# Altium project PCB_Prototype2.PrjPCB
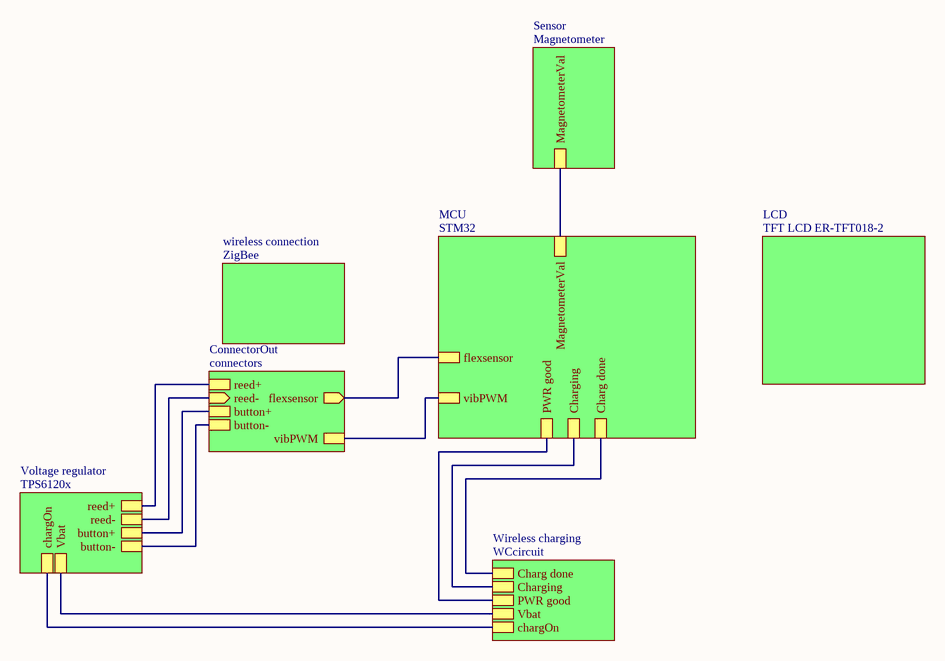
[diagram p0: HGCD.SchDoc]
8 sheets, 85 parts. Net scope: global (net labels, ports and power ports of the same name join across sheets).
Board file: HGCD.PcbDoc
Sheets:
  HGCD.SchDoc
    ConnectorOut = connectors.SchDoc
    wireless connection = ZigBee.SchDoc
    MCU = STM32.SchDoc
    Sensor = Magnetometer.SchDoc
    Voltage regulator = TPS6120x.SchDoc
    Wireless charging = WCcircuit.SchDoc
    LCD = TFT LCD ER-TFT018-2.SchDoc

## Sheet HGCD.SchDoc
size A4

### Sub-sheets
ConnectorOut = connectors: reed- (in), reed+, flexsensor (out), vibPWM, button+, button-
LCD = TFT LCD ER-TFT018-2: no entries
MCU = STM32: flexsensor, vibPWM, MagnetometerVal, Charg done, Charging, PWR good
Sensor = Magnetometer: MagnetometerVal
Voltage regulator = TPS6120x: Vbat, reed-, reed+, button-, button+, chargOn
Wireless charging = WCcircuit: Charg done, Charging, PWR good, Vbat, chargOn
wireless connection = ZigBee: no entries

### Nets
(unnamed): sheet ConnectorOut/reed-, sheet Voltage regulator/reed-
(unnamed): sheet ConnectorOut/reed+, sheet Voltage regulator/reed+
(unnamed): sheet ConnectorOut/flexsensor, sheet MCU/flexsensor
(unnamed): sheet ConnectorOut/vibPWM, sheet MCU/vibPWM
(unnamed): sheet ConnectorOut/button+, sheet Voltage regulator/button+
(unnamed): sheet ConnectorOut/button-, sheet Voltage regulator/button-
(unnamed): sheet MCU/MagnetometerVal, sheet Sensor/MagnetometerVal
(unnamed): sheet MCU/Charg done, sheet Wireless charging/Charg done
(unnamed): sheet MCU/Charging, sheet Wireless charging/Charging
(unnamed): sheet MCU/PWR good, sheet Wireless charging/PWR good
(unnamed): sheet Voltage regulator/Vbat, sheet Wireless charging/Vbat
(unnamed): sheet Voltage regulator/chargOn, sheet Wireless charging/chargOn

## Sheet connectors.SchDoc
size A4
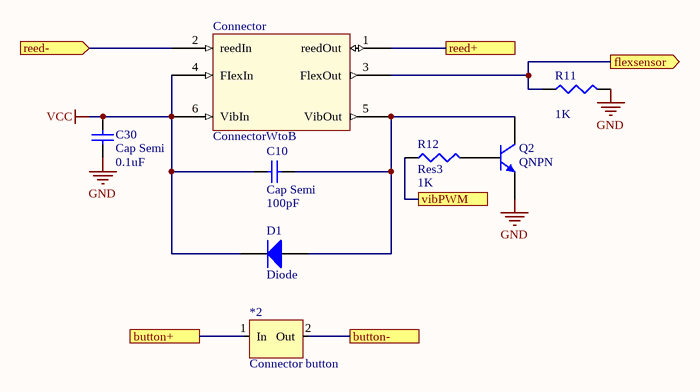
[diagram p1: connectors.SchDoc]

### Parts
*2  Connector button  [Button_connector]
C10  Cap Semi  value 100pF  [1608[0603]]
C30  Cap Semi  value 0.1uF  [1608[0603]]
Connector  ConnectorWtoB  [Connector_wire_to_PCB]
D1  Diode  [SMC]
Q2  QNPN  [SOT-23B_N]
R11  value 1K  [J1-0603]  (hidden comment: Res3)
R12  Res3  value 1K  [J1-0603]

### Ports
button+, button-, flexsensor (out), reed+, reed- (in), vibPWM

### Nets
GND: C30.1 Q2.3(E) R11.2
VCC: *2.2(Out) C10.1 C30.2 Connector.2(reedIn) Connector.4(FIexIn) Connector.6(VibIn) D1.2(K) ; port reed-, port button-
Net*2_1: *2.1(In) Connector.1(reedOut) ; port reed+, port button+
NetC10_2: C10.2 Connector.5(VibOut) D1.1(A) Q2.1(C)
NetConnector_3: Connector.3(FlexOut) R11.1 ; port flexsensor
NetQ2_2: Q2.2(B) R12.2
NetR12_1: R12.1 ; port vibPWM

### Library data of the parts
C10 C30 = Cap Semi: Capacitor (Semiconductor SIM Model); Published: 8-Jun-2000; LatestRevisionDate: 29-May-2009; LatestRevisionNote: IPC-7351 Footprint Added.; PackageReference: C1206; Publisher: Altium Limited; PackageDescription: Chip Capacitor
D1 = Diode: Default Diode; Published: 8-Jun-2000; LatestRevisionDate: 17-Jul-2002; LatestRevisionNote: Re-released for DXP Platform.; PackageVersion: Sep-1996; PackageReference: SMC; Publisher: Altium Limited; PackageDescription: DO-214-AB/SMC; 2 C-Bend Leads; Body 7.9 x 5.9 mm, inc. leads (LxW); Code_JEDEC: DO-214-AB
Q2 = QNPN: NPN Bipolar Transistor; Published: 8-Jun-2000; LatestRevisionDate: 29-May-2009; LatestRevisionNote: IPC-7351 Footprint Added.; PackageReference: SOT-23B; Publisher: Altium Limited; PackageDescription: 3-Pin SOT-23 Package 0.95 mm Pitch, 2.4 mm Lead Span; PackageVersion: Aug-1999
R11 R12 = Res3: Resistor; Published: 8-Jun-2000; LatestRevisionDate: 29-May-2009; LatestRevisionNote: IPC-7351 Footprint Added.; PackageReference: J1-0603; Publisher: Altium Limited; PackageDescription: Chip Resistor

## Sheet ZigBee.SchDoc
size A4
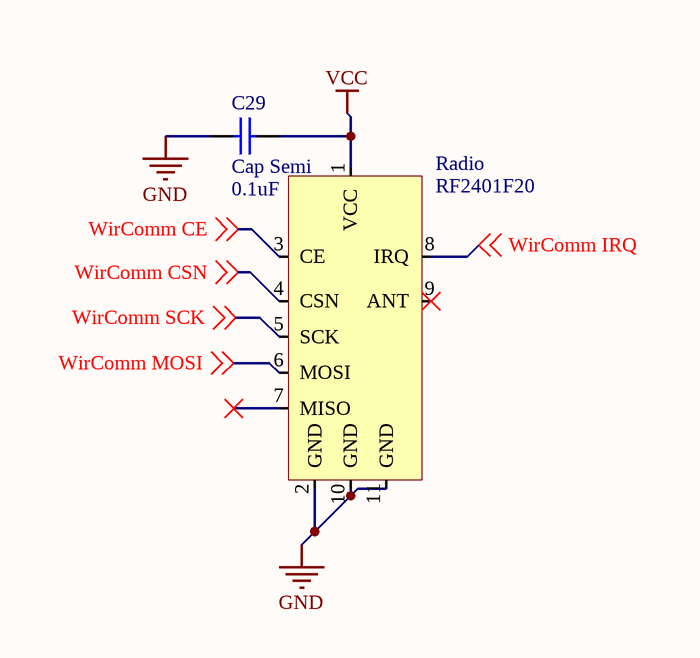
[diagram p2: ZigBee.SchDoc]

### Parts
C29  Cap Semi  value 0.1uF  [1608[0603]]
Radio  RF2401F20  [RF2401F20]

### Nets
GND: C29.2 Radio.2(GND) Radio.10(GND) Radio.11(GND)
VCC: C29.1 Radio.1(VCC)
WirComm CE: Radio.3(CE) ; off-sheet WirComm CE
WirComm CSN: Radio.4(CSN) ; off-sheet WirComm CSN
WirComm IRQ: Radio.8(IRQ) ; off-sheet WirComm IRQ
WirComm MOSI: Radio.6(MOSI) ; off-sheet WirComm MOSI
WirComm SCK: Radio.5(SCK) ; off-sheet WirComm SCK

Not connected (* = marked no-connect by the designer): Radio 7(MISO)* 9(ANT)*

### Library data of the parts
C29 = Cap Semi: Capacitor (Semiconductor SIM Model); Published: 8-Jun-2000; LatestRevisionDate: 29-May-2009; LatestRevisionNote: IPC-7351 Footprint Added.; PackageReference: C1206; Publisher: Altium Limited; PackageDescription: Chip Capacitor

## Sheet STM32.SchDoc
size A4
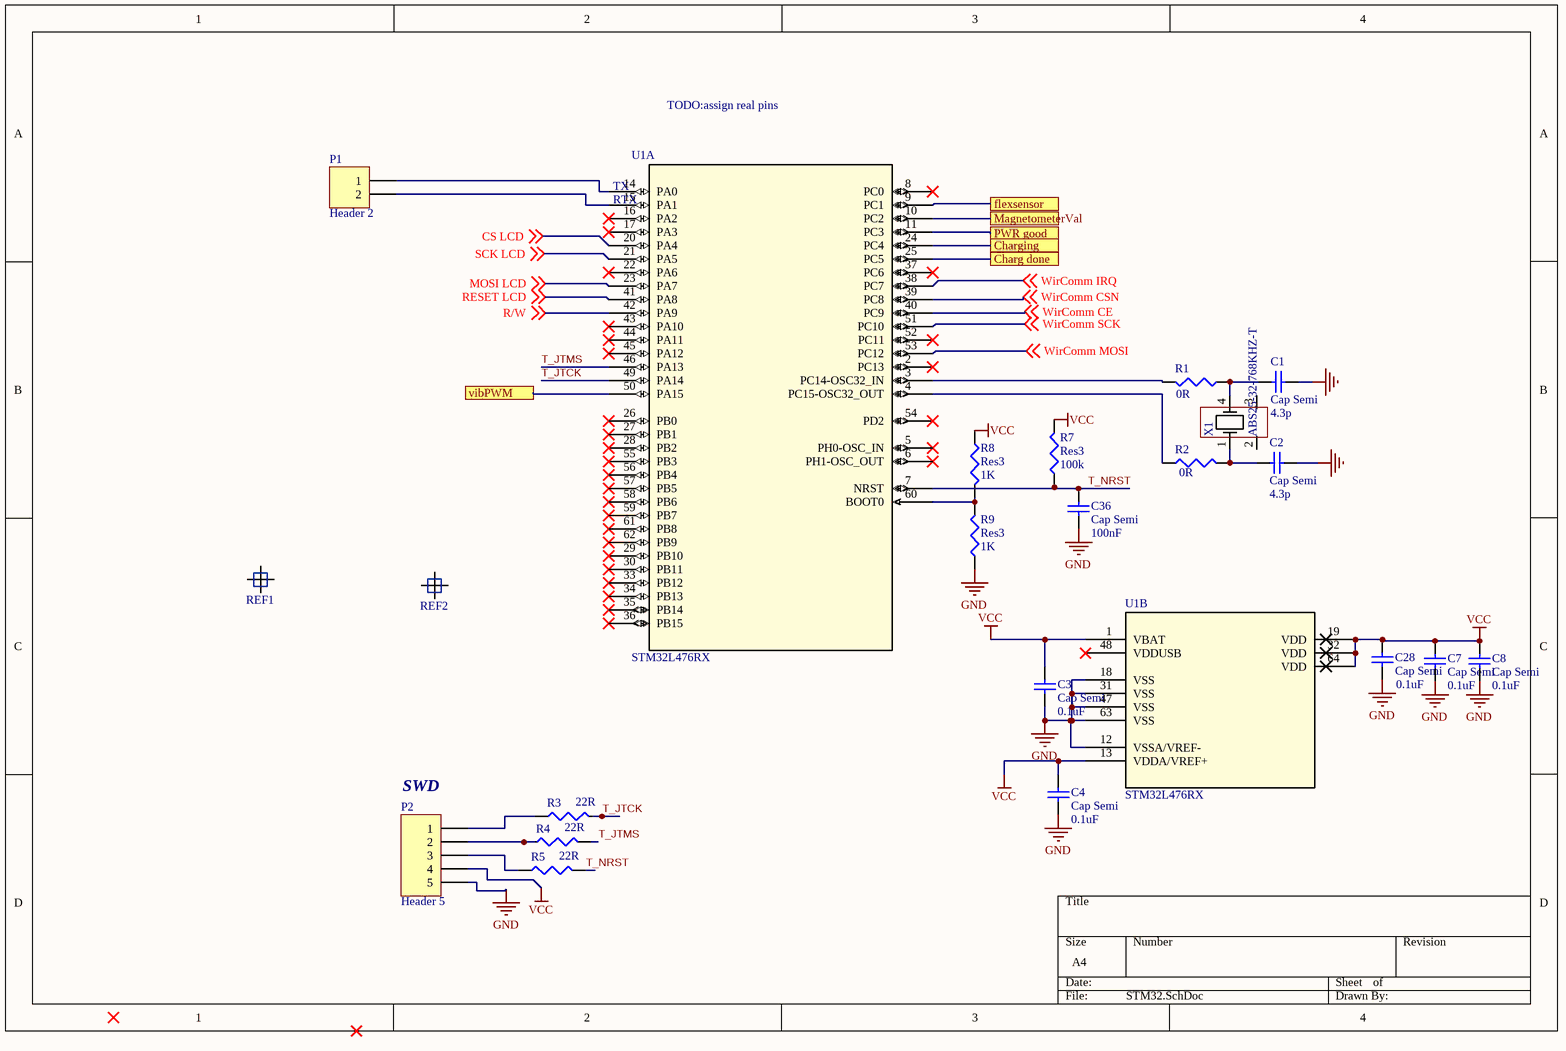
[diagram p3: STM32.SchDoc]

### Parts
C1  Cap Semi  value 4.3p  [1608[0603]]
C2  Cap Semi  value 4.3p  [1608[0603]]
C3  Cap Semi  value 0.1uF  [1608[0603]]
C4  Cap Semi  value 0.1uF  [1608[0603]]
C7  Cap Semi  value 0.1uF  [1608[0603]]
C8  Cap Semi  value 0.1uF  [1608[0603]]
C28  Cap Semi  value 0.1uF  [1608[0603]]
C36  Cap Semi  value 100nF  [1608[0603]]
P1  Header 2  [HDR1X2]
P2  Header 5  [HDR1X5]
R1  value 0R  [J1-0603]  (hidden comment: Res3)
R2  value 0R  [J1-0603]  (hidden comment: Res3)
R3  22R  [J1-0603]
R4  22R  [J1-0603]
R5  22R  [J1-0603]
R7  Res3  value 100k  [J1-0603]
R8  Res3  value 1K  [J1-0603]
R9  Res3  value 1K  [J1-0603]
REF1  Fudical sq.  [FIDUCIAL_SQ1mm_SQ5]  (value not drawn)
REF2  Fudical sq.  [FIDUCIAL_SQ1mm_SQ5]  (value not drawn)
U1  STM32L476RX  [LQFP64-10x10mm]  (parts A,B of 2)
X1  ABS25-32-768KHZ-T  [XTAL_ABS25-32-768KHZ-T]

### Ports
Charg done, Charging, flexsensor, MagnetometerVal, PWR good, vibPWM

### Nets
GND: C1.1 C2.1 C3.1 C4.1 C7.1 C8.1 C28.1 C36.1 P2.5 R9.1 U1.12(VSSA/VREF-) U1.18(VSS) U1.31(VSS) U1.47(VSS) U1.63(VSS)
VCC: C3.2 C4.2 C7.2 C8.2 C28.2 P2.4 R7.2 R8.1 U1.1(VBAT) U1.13(VDDA/VREF+) U1.19(VDD) U1.32(VDD) U1.64(VDD)
CS LCD: U1.20(PA4) ; off-sheet CS LCD
MOSI LCD: U1.23(PA7) ; off-sheet MOSI LCD
R/W: U1.42(PA9) ; off-sheet R/W
RESET LCD: U1.41(PA8) ; off-sheet RESET LCD
SCK LCD: U1.21(PA5) ; off-sheet SCK LCD
T_JTCK: R3.2 U1.49(PA14)
T_JTMS: R4.2 U1.46(PA13)
T_NRST: C36.2 R5.2 R7.1 U1.7(NRST)
WirComm CE: U1.40(PC9) ; off-sheet WirComm CE
WirComm CSN: U1.39(PC8) ; off-sheet WirComm CSN
WirComm IRQ: U1.38(PC7) ; off-sheet WirComm IRQ
WirComm MOSI: U1.53(PC12) ; off-sheet WirComm MOSI
WirComm SCK: U1.51(PC10) ; off-sheet WirComm SCK
Net2_3: U1.25(PC5) ; port Charg done
Net2_4: U1.24(PC4) ; port Charging
Net2_8: U1.11(PC3) ; port PWR good
NetC1_2: C1.2 R1.2 X1.4
NetC2_2: C2.2 R2.2 X1.1
NetC9_2: U1.10(PC2) ; port MagnetometerVal
NetConnector_3: U1.9(PC1) ; port flexsensor
NetP1_1: P1.1 U1.14(PA0)
NetP1_2: P1.2 U1.15(PA1)
NetP2_1: P2.1 R3.1
NetP2_2: P2.2 R4.1
NetP2_3: P2.3 R5.1
NetR1_1: R1.1 U1.3(PC14-OSC32_IN)
NetR2_1: R2.1 U1.4(PC15-OSC32_OUT)
NetR8_2: R8.2 R9.2 U1.60(BOOT0)
NetR12_1: U1.50(PA15) ; port vibPWM

Not connected (* = marked no-connect by the designer): U1 2(PC13)* 5(PH0-OSC_IN)* 6(PH1-OSC_OUT)* 8(PC0)* 16(PA2)* 17(PA3)* 22(PA6)* 26(PB0)* 27(PB1)* 28(PB2)* 29(PB10)* 30(PB11)* 33(PB12)* 34(PB13)* 35(PB14)* 36(PB15)* 37(PC6)* 43(PA10)* 44(PA11)* 45(PA12)* 48(VDDUSB)* 52(PC11)* 54(PD2)* 55(PB3)* 56(PB4)* 57(PB5)* 58(PB6)* 59(PB7)* 61(PB8)* 62(PB9)*; X1 2 3

### Notes on the sheet
- TODO:assign real pins
- (near U1) TX
- (near U1) RTX
- (near P2) SWD

### Library data of the parts
C1-C4 C7 C8 C28 C36 = Cap Semi: Capacitor (Semiconductor SIM Model); Published: 8-Jun-2000; LatestRevisionDate: 29-May-2009; LatestRevisionNote: IPC-7351 Footprint Added.; PackageReference: C1206; Publisher: Altium Limited; PackageDescription: Chip Capacitor
P1 = Header 2: Header, 2-Pin; LatestRevisionDate: 17-Jul-2002; LatestRevisionNote: Re-released for DXP Platform.; Publisher: Altium Limited
P2 = Header 5: Header, 5-Pin; LatestRevisionDate: 17-Jul-2002; LatestRevisionNote: Re-released for DXP Platform.; Publisher: Altium Limited
R1 R2 R7-R9 = Res3: Resistor; Published: 8-Jun-2000; Publisher: Altium Limited; LatestRevisionDate: 29-May-2009; LatestRevisionNote: IPC-7351 Footprint Added.; PackageReference: J1-0603; PackageDescription: Chip Resistor
R3-R5 = Res3: Resistor; Value: 1K; Published: 8-Jun-2000; LatestRevisionDate: 29-May-2009; LatestRevisionNote: IPC-7351 Footprint Added.; PackageReference: J1-0603; Publisher: Altium Limited; PackageDescription: Chip Resistor
REF1 REF2 = Fudicalsquare: Fiducal square 1mm
U1 = STM32L476RX: Imported; Vendor: ST Microelectronics; Copyright: Copyright (C) 2016 Accelerated Designs. All rights reserved; Manufacturer_Part_Number: stm32l476rx; Value: Value; Type: Type; RefDes: RefDes
X1 = ABS25-32-768KHZ-T: MF: Abracon; SnapEDA_Link: https://www.snapeda.com/symbols-footprints/ABS25-32-768KHZ-T/Abracon/view-part/?ref=snap; MP: ABS25-32-768KHZ-T; Availability: Unavailable; Price: None; Package: None; Value: *

## Sheet Magnetometer.SchDoc
size A4
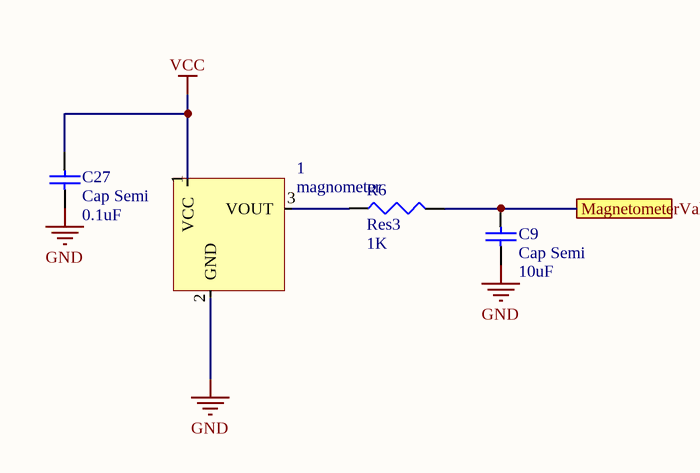
[diagram p4: Magnetometer.SchDoc]

### Parts
1  magnometer  [SIP-3]
C9  Cap Semi  value 10uF  [1608[0603]]
C27  Cap Semi  value 0.1uF  [1608[0603]]
R6  Res3  value 1K  [J1-0603]

### Ports
MagnetometerVal

### Nets
GND: 1.2(GND) C9.1 C27.1
VCC: 1.1(VCC) C27.2
Net1_3: 1.3(VOUT) R6.1
NetC9_2: C9.2 R6.2 ; port MagnetometerVal

### Library data of the parts
C9 C27 = Cap Semi: Capacitor (Semiconductor SIM Model); Published: 8-Jun-2000; LatestRevisionDate: 29-May-2009; LatestRevisionNote: IPC-7351 Footprint Added.; PackageReference: C1206; Publisher: Altium Limited; PackageDescription: Chip Capacitor
R6 = Res3: Resistor; Published: 8-Jun-2000; LatestRevisionDate: 29-May-2009; LatestRevisionNote: IPC-7351 Footprint Added.; PackageReference: J1-0603; Publisher: Altium Limited; PackageDescription: Chip Resistor

## Sheet TPS6120x.SchDoc
size A4
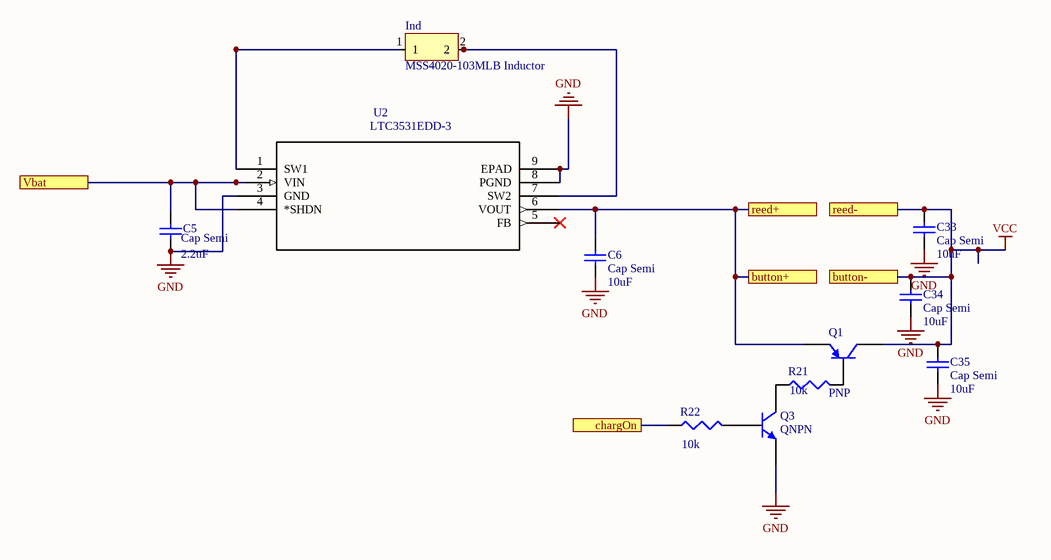
[diagram p5: TPS6120x.SchDoc]

### Parts
C5  Cap Semi  value 2.2uF  [1608[0603]]
C6  Cap Semi  value 10uF  [1608[0603]]
C33  Cap Semi  value 10uF  [1608[0603]]
C34  Cap Semi  value 10uF  [1608[0603]]
C35  Cap Semi  value 10uF  [1608[0603]]
Ind  MSS4020-103MLB Inductor  [MSS4020-103MLB]
Q1  PNP  [SOT-23B_N]
Q3  QNPN  [SOT-23B_N]
R21  value 10k  [J1-0603]  (hidden comment: Res3)
R22  value 10k  [J1-0603]  (hidden comment: Res3)
U2  LTC3531EDD-3  [LTC3531EDD-3]

### Ports
button+, button-, chargOn, reed+, reed-, Vbat

### Nets
GND: C5.1 C6.1 C33.1 C34.1 C35.1 Q3.3(E) U2.3(GND) U2.8(PGND) U2.9(EPAD)
VCC: C33.2 C34.2 C35.2 Q1.1(C) ; port button-, port reed-
Net2_1: R22.1 ; port chargOn
Net*2_1: C6.2 Q1.3(E) U2.6(VOUT) ; port button+, port reed+
NetC5_2: C5.2 U2.2(VIN) U2.4(*SHDN) ; port Vbat
NetInd_1: Ind.1 U2.1(SW1)
NetInd_2: Ind.2 U2.7(SW2)
NetQ1_2: Q1.2(B) R21.2
NetQ3_1: Q3.1(C) R21.1
NetQ3_2: Q3.2(B) R22.2

Not connected (* = marked no-connect by the designer): U2 5(FB)*

### Library data of the parts
C5 C6 C33-C35 = Cap Semi: Capacitor (Semiconductor SIM Model); Published: 8-Jun-2000; LatestRevisionDate: 29-May-2009; LatestRevisionNote: IPC-7351 Footprint Added.; PackageReference: C1206; Publisher: Altium Limited; PackageDescription: Chip Capacitor
Q1 = PNP: PNP Bipolar Transistor; Published: 8-Jun-2000; LatestRevisionDate: 29-May-2009; LatestRevisionNote: IPC-7351 Footprint Added.; PackageVersion: Aug-1999; PackageReference: SOT-23B; Publisher: Altium Limited; PackageDescription: 3-Pin SOT-23 Package 0.95 mm Pitch, 2.4 mm Lead Span
Q3 = QNPN: NPN Bipolar Transistor; Published: 8-Jun-2000; LatestRevisionDate: 29-May-2009; LatestRevisionNote: IPC-7351 Footprint Added.; PackageVersion: Aug-1999; PackageReference: SOT-23B; Publisher: Altium Limited; PackageDescription: 3-Pin SOT-23 Package 0.95 mm Pitch, 2.4 mm Lead Span
R21 R22 = Res3: Resistor; Published: 8-Jun-2000; LatestRevisionDate: 29-May-2009; LatestRevisionNote: IPC-7351 Footprint Added.; PackageReference: J1-0603; Publisher: Altium Limited; PackageDescription: Chip Resistor
U2 = LTC3531EDD-3: LTC3531 - 200mA Buck-Boost Synchronous DC/DC Converters; MF: Linear Technology; Price: None; SnapEDA_Link: https://www.snapeda.com/parts/LTC3531EDD-3/Linear%20Technology/view-part/?ref=snap; Availability: Unavailable; MP: LTC3531EDD-3; Package: None; Value: *

## Sheet WCcircuit.SchDoc
size A4
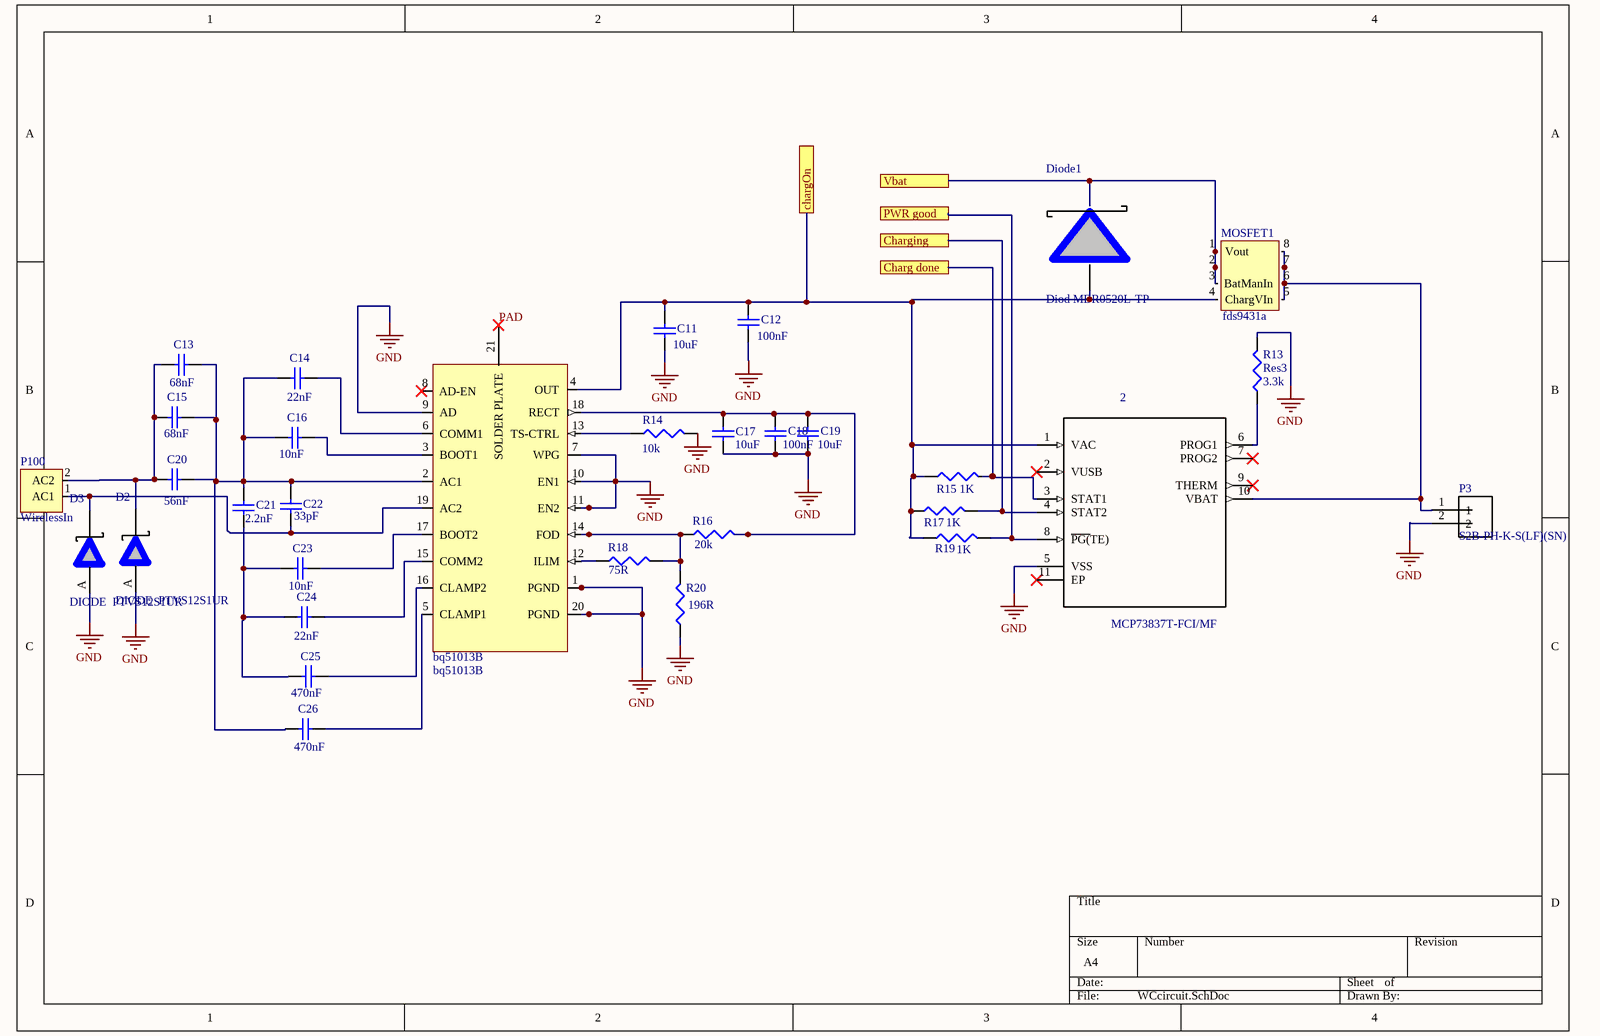
[diagram p6: WCcircuit.SchDoc]

### Parts
2  MCP73837T-FCI/MF  [DFN300X300X100-11N]
bq51013B  bq51013B  [CONTROLLER_MSP430FR2522IRHLT]
C11  value 10uF  [1608[0603]]  (hidden comment: Cap Semi)
C12  value 100nF  [1608[0603]]  (hidden comment: Cap Semi)
C13  value 68nF  [1608[0603]]  (hidden comment: Cap Semi)
C14  value 22nF  [1608[0603]]  (hidden comment: Cap Semi)
C15  value 68nF  [1608[0603]]  (hidden comment: Cap Semi)
C16  value 10nF  [1608[0603]]  (hidden comment: Cap Semi)
C17  value 10uF  [1608[0603]]  (hidden comment: Cap Semi)
C18  value 100nF  [1608[0603]]  (hidden comment: Cap Semi)
C19  value 10uF  [1608[0603]]  (hidden comment: Cap Semi)
C20  value 56nF  [1608[0603]]  (hidden comment: Cap Semi)
C21  value 2.2nF  [1608[0603]]  (hidden comment: Cap Semi)
C22  value 33pF  [1608[0603]]  (hidden comment: Cap Semi)
C23  value 10nF  [1608[0603]]  (hidden comment: Cap Semi)
C24  value 22nF  [1608[0603]]  (hidden comment: Cap Semi)
C25  value 470nF  [1608[0603]]  (hidden comment: Cap Semi)
C26  value 470nF  [1608[0603]]  (hidden comment: Cap Semi)
D2  DIODE  PTVS12S1UR  [PTVS12S1UR]
D3  DIODE  PTVS12S1UR  [PTVS12S1UR]
Diode1  Diod MBR0520L-TP  [SOD3716X135N]
MOSFET1  fds9431a  [SOIC127P600X175-8N]
P3  S2B-PH-K-S(LF)(SN)  [JST_S2B-PH-K-S(LF)(SN)]
P100  WirelessIn  [WirelessIn]
R13  Res3  value 3.3k  [J1-0603]
R14  value 10k  [J1-0603]  (hidden comment: Res3)
R15  value 1K  [J1-0603]  (hidden comment: Res3)
R16  value 20k  [J1-0603]  (hidden comment: Res3)
R17  value 1K  [J1-0603]  (hidden comment: Res3)
R18  value 75R  [J1-0603]  (hidden comment: Res3)
R19  value 1K  [J1-0603]  (hidden comment: Res3)
R20  value 196R  [J1-0603]  (hidden comment: Res3)

### Ports
Charg done, Charging, chargOn, PWR good, Vbat

### Nets
GND: 2.5(VSS) bq51013B.1(PGND) bq51013B.7(WPG) bq51013B.9(AD) bq51013B.10(EN1) bq51013B.11(EN2) bq51013B.20(PGND) C11.1 C12.1 C17.1 C18.1 C19.1 D2.A D3.A P3.2 R13.2 R14.2 R20.1
PAD: bq51013B.21(SOLDER_PLATE)
Net2_1: 2.1(VAC) bq51013B.4(OUT) C11.2 C12.2 Diode1.A MOSFET1.4(ChargVIn) R15.1 R17.1 R19.1 ; port chargOn
Net2_3: 2.3(STAT1) R15.2 ; port Charg done
Net2_4: 2.4(STAT2) R17.2 ; port Charging
Net2_6: 2.6(PROG1) R13.1
Net2_8: 2.8(~{PG(}TE)) R19.2 ; port PWR good
Net2_10: 2.10(VBAT) MOSFET1.5 MOSFET1.6(BatManIn) MOSFET1.7 MOSFET1.8 P3.1
Netbq51013B_2: bq51013B.2(AC1) C13.2 C14.1 C15.2 C16.1 C20.2 C21.2 C22.2 C26.1
Netbq51013B_3: bq51013B.3(BOOT1) C16.2
Netbq51013B_5: bq51013B.5(CLAMP1) C26.2
Netbq51013B_6: bq51013B.6(COMM1) C14.2
Netbq51013B_12: bq51013B.12(ILIM) R18.1
Netbq51013B_13: bq51013B.13(TS-CTRL) R14.1
Netbq51013B_14: bq51013B.14(FOD) R16.1 R18.2 R20.2
Netbq51013B_15: bq51013B.15(COMM2) C24.2
Netbq51013B_16: bq51013B.16(CLAMP2) C25.2
Netbq51013B_17: bq51013B.17(BOOT2) C23.2
Netbq51013B_18: bq51013B.18(RECT) C17.2 C18.2 C19.2 R16.2
Netbq51013B_19: bq51013B.19(AC2) C22.1 D3.C P100.1(AC1)
NetC5_2: Diode1.C MOSFET1.1(Vout) MOSFET1.2 MOSFET1.3 ; port Vbat
NetC13_1: C13.1 C15.1 C20.1 D2.C P100.2(AC2)
NetC21_1: C21.1 C23.1 C24.1 C25.1

Not connected (* = marked no-connect by the designer): 2 2(VUSB)* 7(PROG2)* 9(THERM)* 11(EP)*; bq51013B 8(AD-EN)*

### Notes on the sheet
- (in symbol MCP73837T-FCI/MF) Text

### Library data of the parts
2 = MCP73837T-FCI/MF: MCP73837 Series 6 V Linear Battery Charge Controller Surface Mount - DFN-10; MF: Microchip; Package: DFN-10 Microchip; SnapEDA_Link: https://www.snapeda.com/symbols-footprints/MCP73837T-FCI/MF/Microchip/view-part/?ref=snap; MP: MCP73837T-FCI/MF; Availability: Good; Price: 0.98 USD; Value: *
C11-C26 = Cap Semi: Capacitor (Semiconductor SIM Model); Published: 8-Jun-2000; LatestRevisionDate: 29-May-2009; LatestRevisionNote: IPC-7351 Footprint Added.; PackageReference: C1206; Publisher: Altium Limited; PackageDescription: Chip Capacitor
P3 = S2B-PH-K-S(LF)(SN): Header Side Entry 2way; MF: JST; SnapEDA_Link: https://www.snapeda.com/symbols-footprints/S2B-PH-K-S%20%28LF%29%28SN%29/JST/view-part/?ref=snap; Availability: Good; Package: None; Price: 0.12 USD; MP: S2B-PH-K-S (LF)(SN); Value: *
R13-R20 = Res3: Resistor; Published: 8-Jun-2000; LatestRevisionDate: 29-May-2009; LatestRevisionNote: IPC-7351 Footprint Added.; PackageReference: J1-0603; Publisher: Altium Limited; PackageDescription: Chip Resistor

## Sheet TFT LCD ER-TFT018-2.SchDoc
size A4
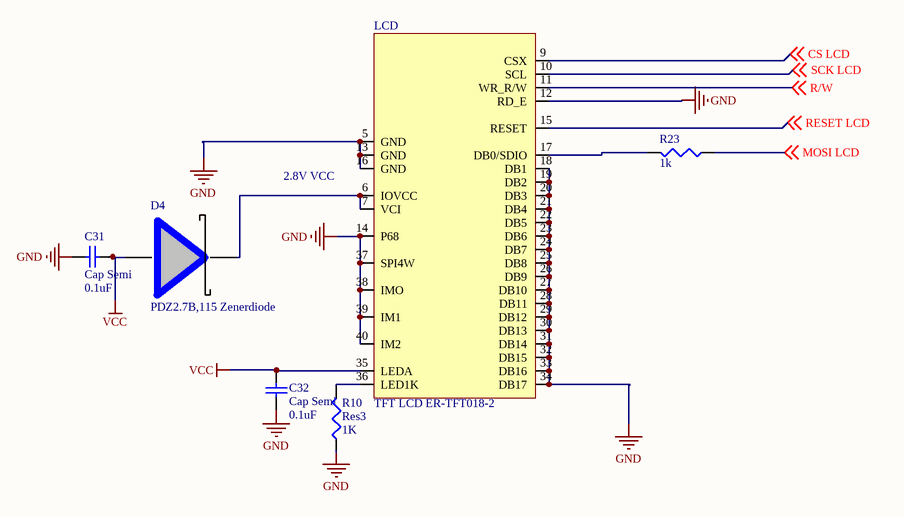
[diagram p7: TFT LCD ER-TFT018-2.SchDoc]

### Parts
C31  Cap Semi  value 0.1uF  [1608[0603]]
C32  Cap Semi  value 0.1uF  [1608[0603]]
D4  PDZ2.7B,115 Zenerdiode  [PDZ2.7B,115]
LCD  TFT LCD ER-TFT018-2  [LCD TFT Display]
R10  Res3  value 1K  [J1-0603]
R23  value 1k  [J1-0603]  (hidden comment: Res3)

### Nets
GND: C31.1 C32.1 LCD.5(GND) LCD.12(RD_E) LCD.13(GND) LCD.14(P68) LCD.16(GND) LCD.18(DB1) LCD.19(DB2) LCD.20(DB3) LCD.21(DB4) LCD.22(DB5) LCD.23(DB6) LCD.24(DB7) LCD.25(DB8) LCD.26(DB9) LCD.27(DB10) LCD.28(DB11) LCD.29(DB12) LCD.30(DB13) LCD.31(DB14) LCD.32(DB15) LCD.33(DB16) LCD.34(DB17) LCD.37(SPI4W) LCD.38(IMO) LCD.39(IM1) LCD.40(IM2) R10.1
VCC: C31.2 C32.2 D4.2 LCD.35(LEDA)
CS LCD: LCD.9(CSX) ; off-sheet CS LCD
MOSI LCD: R23.1 ; off-sheet MOSI LCD
R/W: LCD.11(WR_R/W) ; off-sheet R/W
RESET LCD: LCD.15(RESET) ; off-sheet RESET LCD
SCK LCD: LCD.10(SCL) ; off-sheet SCK LCD
NetD4_1: D4.1 LCD.6(IOVCC) LCD.7(VCI)
NetLCD_17: LCD.17(DB0/SDIO) R23.2
NetLCD_36: LCD.36(LED1K) R10.2

### Notes on the sheet
- (near LCD) 2.8V VCC

### Library data of the parts
C31 C32 = Cap Semi: Capacitor (Semiconductor SIM Model); Published: 8-Jun-2000; LatestRevisionDate: 29-May-2009; LatestRevisionNote: IPC-7351 Footprint Added.; PackageReference: C1206; Publisher: Altium Limited; PackageDescription: Chip Capacitor
R10 R23 = Res3: Resistor; Published: 8-Jun-2000; LatestRevisionDate: 29-May-2009; LatestRevisionNote: IPC-7351 Footprint Added.; PackageReference: J1-0603; Publisher: Altium Limited; PackageDescription: Chip Resistor

## Nets that join several sheets
GND: connectors (C30.1 Q2.3 R11.2), ZigBee (C29.2 Radio.2 Radio.10 Radio.11), STM32 (15 pins), Magnetometer (1.2 C9.1 C27.1), TPS6120x (9 pins), WCcircuit (18 pins), TFT LCD ER-TFT018-2 (29 pins)
VCC: connectors (7 pins), ZigBee (C29.1 Radio.1), STM32 (13 pins), Magnetometer (1.1 C27.2), TPS6120x (C33.2 C34.2 C35.2 Q1.1), TFT LCD ER-TFT018-2 (C31.2 C32.2 D4.2 LCD.35)
CS LCD: STM32 (U1.20), TFT LCD ER-TFT018-2 (LCD.9)
MOSI LCD: STM32 (U1.23), TFT LCD ER-TFT018-2 (R23.1)
Net2_1: TPS6120x (R22.1), WCcircuit (9 pins)
Net2_3: STM32 (U1.25), WCcircuit (2.3 R15.2)
Net2_4: STM32 (U1.24), WCcircuit (2.4 R17.2)
Net2_8: STM32 (U1.11), WCcircuit (2.8 R19.2)
Net*2_1: connectors (*2.1 Connector.1), TPS6120x (C6.2 Q1.3 U2.6)
NetC5_2: TPS6120x (C5.2 U2.2 U2.4), WCcircuit (Diode1.C MOSFET1.1 MOSFET1.2 MOSFET1.3)
NetC9_2: STM32 (U1.10), Magnetometer (C9.2 R6.2)
NetConnector_3: connectors (Connector.3 R11.1), STM32 (U1.9)
NetR12_1: connectors (R12.1), STM32 (U1.50)
R/W: STM32 (U1.42), TFT LCD ER-TFT018-2 (LCD.11)
RESET LCD: STM32 (U1.41), TFT LCD ER-TFT018-2 (LCD.15)
SCK LCD: STM32 (U1.21), TFT LCD ER-TFT018-2 (LCD.10)
WirComm CE: ZigBee (Radio.3), STM32 (U1.40)
WirComm CSN: ZigBee (Radio.4), STM32 (U1.39)
WirComm IRQ: ZigBee (Radio.8), STM32 (U1.38)
WirComm MOSI: ZigBee (Radio.6), STM32 (U1.53)
WirComm SCK: ZigBee (Radio.5), STM32 (U1.51)